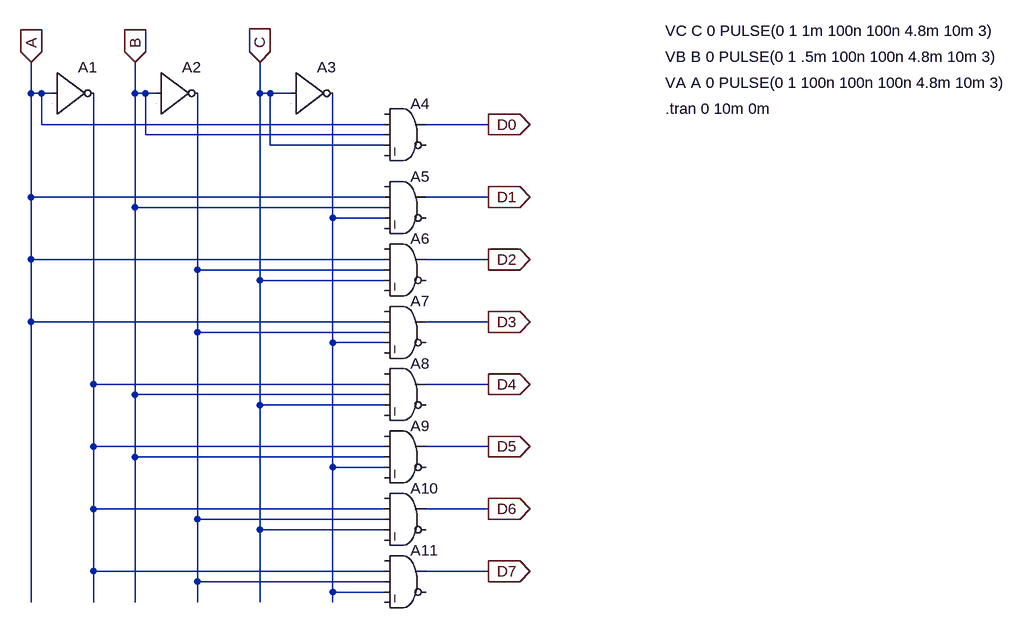
[diagram p0: schematic Part2.asc]
Part2.asc, the LTspice schematic file:
Version 4
SHEET 1 1552 856
WIRE 16 48 16 0
WIRE 32 48 16 48
WIRE 48 48 32 48
WIRE 176 48 176 0
WIRE 192 48 176 48
WIRE 208 48 192 48
WIRE 368 48 368 0
WIRE 384 48 368 48
WIRE 416 48 384 48
WIRE 32 96 32 48
WIRE 560 96 32 96
WIRE 720 96 624 96
WIRE 192 112 192 48
WIRE 560 112 192 112
WIRE 384 128 384 48
WIRE 560 128 384 128
WIRE 16 208 16 48
WIRE 560 208 16 208
WIRE 720 208 624 208
WIRE 176 224 176 48
WIRE 560 224 176 224
WIRE 480 240 480 48
WIRE 560 240 480 240
WIRE 16 304 16 208
WIRE 560 304 16 304
WIRE 720 304 624 304
WIRE 272 320 272 48
WIRE 560 320 272 320
WIRE 368 336 368 48
WIRE 560 336 368 336
WIRE 16 400 16 304
WIRE 560 400 16 400
WIRE 720 400 624 400
WIRE 272 416 272 320
WIRE 560 416 272 416
WIRE 480 432 480 240
WIRE 560 432 480 432
WIRE 112 496 112 48
WIRE 560 496 112 496
WIRE 720 496 624 496
WIRE 176 512 176 224
WIRE 560 512 176 512
WIRE 368 528 368 336
WIRE 560 528 368 528
WIRE 112 592 112 496
WIRE 560 592 112 592
WIRE 720 592 624 592
WIRE 176 608 176 512
WIRE 560 608 176 608
WIRE 480 624 480 432
WIRE 560 624 480 624
WIRE 112 688 112 592
WIRE 560 688 112 688
WIRE 720 688 624 688
WIRE 272 704 272 416
WIRE 560 704 272 704
WIRE 368 720 368 528
WIRE 560 720 368 720
WIRE 112 784 112 688
WIRE 560 784 112 784
WIRE 720 784 624 784
WIRE 272 800 272 704
WIRE 560 800 272 800
WIRE 480 816 480 624
WIRE 560 816 480 816
WIRE 16 832 16 400
WIRE 112 832 112 784
WIRE 176 832 176 608
WIRE 272 832 272 800
WIRE 368 832 368 720
WIRE 480 832 480 816
FLAG 16 0 A
IOPIN 16 0 In
FLAG 176 0 B
IOPIN 176 0 In
FLAG 368 0 C
IOPIN 368 0 In
FLAG 720 96 D0
IOPIN 720 96 Out
FLAG 720 208 D1
IOPIN 720 208 Out
FLAG 720 304 D2
IOPIN 720 304 Out
FLAG 720 400 D3
IOPIN 720 400 Out
FLAG 720 496 D4
IOPIN 720 496 Out
FLAG 720 592 D5
IOPIN 720 592 Out
FLAG 720 688 D6
IOPIN 720 688 Out
FLAG 720 784 D7
IOPIN 720 784 Out
SYMBOL Digital\\inv 48 -16 R0
SYMATTR InstName A1
SYMBOL Digital\\inv 208 -16 R0
SYMATTR InstName A2
SYMBOL Digital\\inv 416 -16 R0
SYMATTR InstName A3
SYMBOL Digital\\and 592 48 R0
SYMATTR InstName A4
SYMBOL Digital\\and 592 160 R0
SYMATTR InstName A5
SYMBOL Digital\\and 592 256 R0
SYMATTR InstName A6
SYMBOL Digital\\and 592 352 R0
SYMATTR InstName A7
SYMBOL Digital\\and 592 448 R0
SYMATTR InstName A8
SYMBOL Digital\\and 592 544 R0
SYMATTR InstName A9
SYMBOL Digital\\and 592 640 R0
SYMATTR InstName A10
SYMBOL Digital\\and 592 736 R0
SYMATTR InstName A11
TEXT 992 -48 Left 2 !VC C 0 PULSE(0 1 1m 100n 100n 4.8m 10m 3)
TEXT 992 -8 Left 2 !VB B 0 PULSE(0 1 .5m 100n 100n 4.8m 10m 3)
TEXT 992 32 Left 2 !VA A 0 PULSE(0 1 100n 100n 100n 4.8m 10m 3)
TEXT 992 72 Left 2 !.tran 0 10m 0m

The netlist it stands for:
* Part2.asc
A1 A 0 0 0 0 N003 0 0 BUF
A2 B 0 0 0 0 N002 0 0 BUF
A3 C 0 0 0 0 N001 0 0 BUF
A4 0 A B C 0 0 D0 0 AND
A5 0 A B N001 0 0 D1 0 AND
A6 0 A N002 C 0 0 D2 0 AND
A7 0 A N002 N001 0 0 D3 0 AND
A8 0 N003 B C 0 0 D4 0 AND
A9 0 N003 B N001 0 0 D5 0 AND
A10 0 N003 N002 C 0 0 D6 0 AND
A11 0 N003 N002 N001 0 0 D7 0 AND
VC C 0 PULSE(0 1 1m 100n 100n 4.8m 10m 3)
VB B 0 PULSE(0 1 .5m 100n 100n 4.8m 10m 3)
VA A 0 PULSE(0 1 100n 100n 100n 4.8m 10m 3)
.tran 0 10m 0m
.backanno
.end